# Altium schematic sheet Output buffer A and B. Page 2.SchDoc
size 420 x 297 mm; Address1: Address1; Address2: Address2; Address3: Address3; Address4: Address4; DocumentNumber: АБВГ.123456.001 Э3; SheetNumber: 2; SheetTotal: 5; Scale: 1:1; DocumentType: Схема электрическая принципиальная; FirstReferrence: АБВГ.123456.001
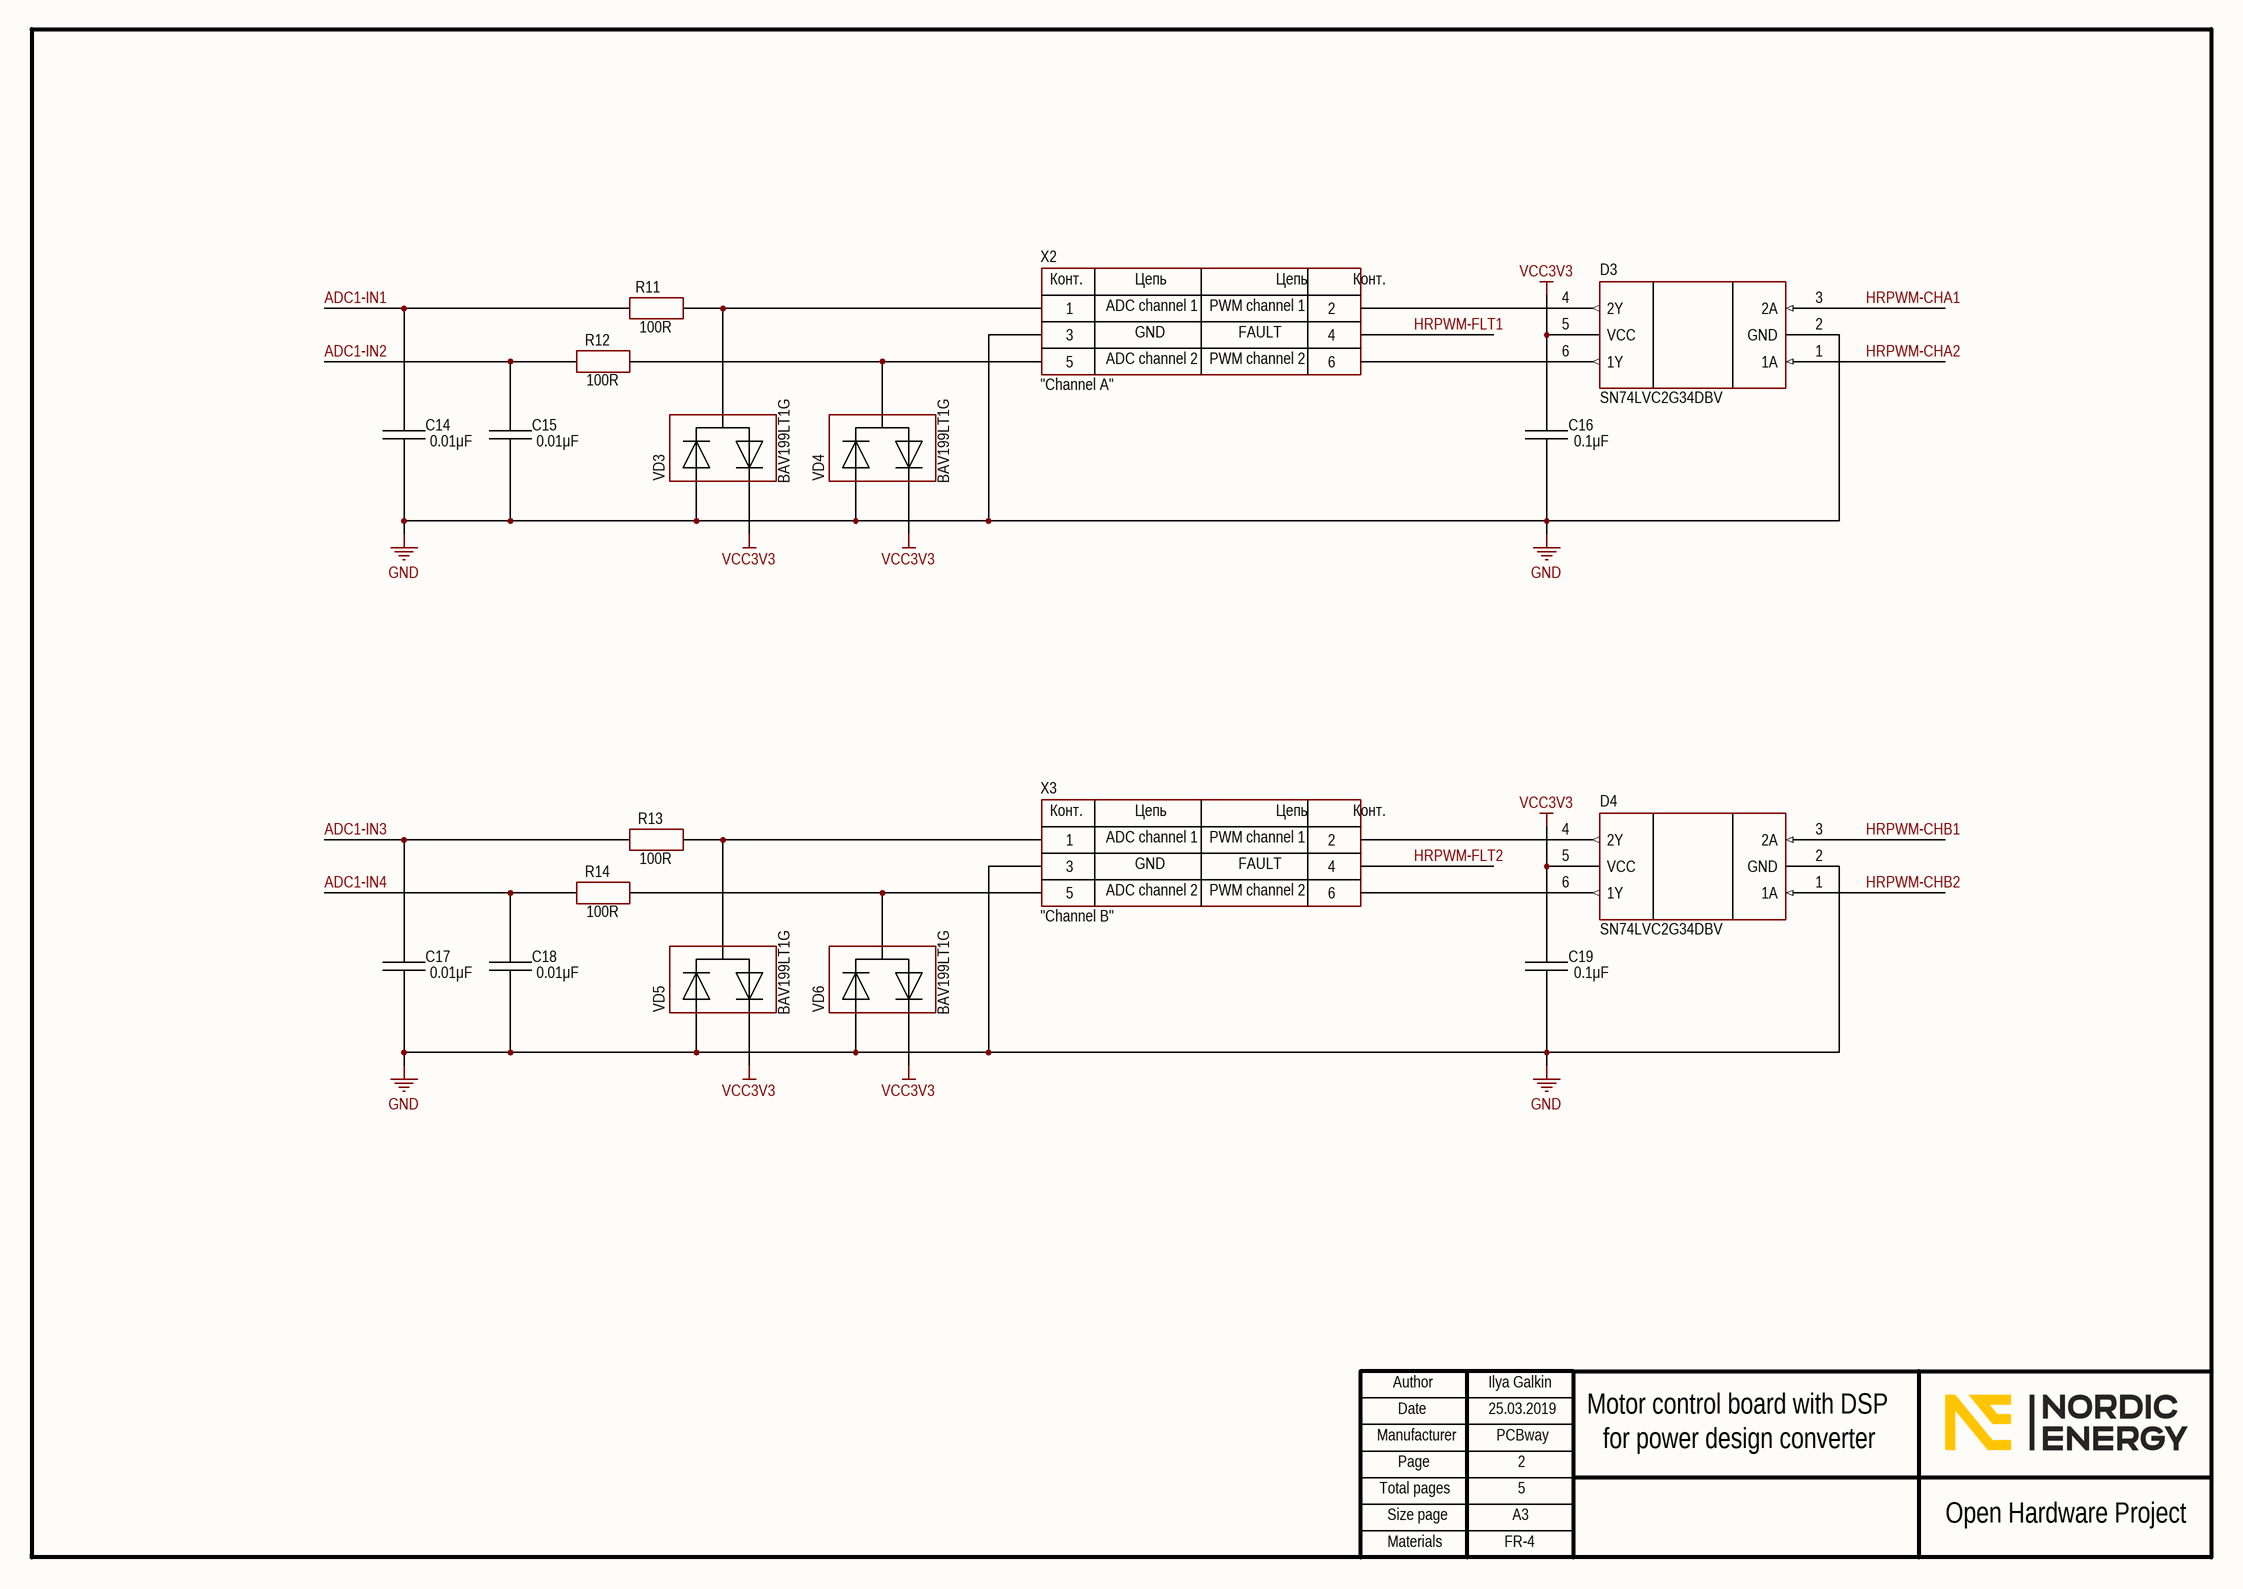
[diagram p0: Output buffer A and B. Page 2.SchDoc]

## Parts
C14  0.01μF  [CH0805C]
C15  0.01μF  [CH0805C]
C16  0.1μF  [CH0805C]
C17  0.01μF  [CH0805C]
C18  0.01μF  [CH0805C]
C19  0.1μF  [CH0805C]
D3  SN74LVC2G34DBV  [SOT23-6]
D4  SN74LVC2G34DBV  [SOT23-6]
R11  100R  [CH0805R]
R12  100R  [CH0805R]
R13  100R  [CH0805R]
R14  100R  [CH0805R]
VD3  BAV199LT1G  [SOT23_132]
VD4  BAV199LT1G  [SOT23_132]
VD5  BAV199LT1G  [SOT23_132]
VD6  BAV199LT1G  [SOT23_132]
X2  "Channel A"  [CON: PLD-6]
X3  "Channel B"  [CON: PLD-6]

## Nets
GND: C14.1 C15.1 C16.1 C17.1 C18.1 C19.1 D3.2(GND) D4.2(GND) VD3.1 VD4.1 VD5.1 VD6.1 X2.3 X3.3
VCC3V3: C16.2 C19.2 D3.5(VCC) D4.5(VCC) VD3.2 VD4.2 VD5.2 VD6.2
ADC1-IN1: C14.2 R11.1
ADC1-IN2: C15.2 R12.1
ADC1-IN3: C17.2 R13.1
ADC1-IN4: C18.2 R14.1
HRPWM-CHA1: D3.3(2A)
HRPWM-CHA2: D3.1(1A)
HRPWM-CHB1: D4.3(2A)
HRPWM-CHB2: D4.1(1A)
HRPWM-FLT1: X2.4
HRPWM-FLT2: X3.4
NetD3_4: D3.4(2Y) X2.2
NetD3_6: D3.6(1Y) X2.6
NetD4_4: D4.4(2Y) X3.2
NetD4_6: D4.6(1Y) X3.6
NetR11_2: R11.2 VD3.3 X2.1
NetR12_2: R12.2 VD4.3 X2.5
NetR13_2: R13.2 VD5.3 X3.1
NetR14_2: R14.2 VD6.3 X3.5

## Notes on the sheet
- (near X2) ADC channel 1
- (near X2) PWM channel 1
- (near X2) ADC channel 2
- (near X2) GND
- (near X2) PWM channel 2
- (near X2) FAULT
- (near X3) ADC channel 1
- (near X3) GND
- (near X3) PWM channel 1
- (near X3) FAULT
- (near X3) ADC channel 2
- (near X3) PWM channel 2
- Ilya Galkin
- 25.03.2019
- PCBway
- 2
- Motor control board with DSP
- for power design converter
- 5
- FR-4
- Author
- Manufacturer
- Date
- Page
- Total pages
- Size page
- A3
- Open Hardware Project
- Materials
- (in symbol 6(2)-Connector) Конт.; Цепь

## Library data of the parts
C14 C15 C17 C18 = Capacitor: Manufacturer: Yageo; Model: CC0805KRX7R9BB103; HelpURL: https://www.digikey.com/product-detail/en/yageo/CC0805KRX7R9BB103/311-1136-1-ND/303046; ComponentKind: X7R; Value: 0.01μF
C16 C19 = Capacitor: Manufacturer: Yageo; Model: CC0805KRX7R7BB104; HelpURL: https://www.digikey.com/product-detail/en/yageo/CC0805KRX7R7BB104/311-1142-1-ND/303052; ComponentKind: X7R; Value: 0.1μF
D3 D4 = SN74LVC2G34DBV: Buffer; Manufacturer: Texas Instruments; Model: SN74LVC2G34DBV; HelpURL: https://www.digikey.com/product-detail/en/texas-instruments/SN74LVC2G34DBVR/296-13496-1-ND/486431; ComponentKind: SOT-23-6
R11-R14 = Resistor: Manufacturer: Yageo; Model: RC0805JR-07100RL; HelpURL: https://www.digikey.com/product-detail/en/yageo/RC0805JR-07100RL/311-100ARCT-ND/731185; ComponentKind: ±5%; Value: 100R
VD3-VD6 = Diod Array: Manufacturer: ON Semiconductor; ComponentKind: 70V; Model: BAV199LT1G; HelpURL: https://www.digikey.com/product-detail/en/on-semiconductor/BAV199LT1G/BAV199LT1GOSCT-ND/917816
X2 X3 = 6(2)-Connector: Model: *; Manufacturer: *; HelpURL: *; ComponentKind: *